# Altium schematic sheet dram.SCHDOC: Gecko3: DDR SDRAM
size A3; Organization: Berne School of Applied Science; Address1: School of Engineering and; Address2: Information Technology; Address3: Quellgasse 21; Address4: CH-2501 Biel; Revision: 0.9; SheetNumber: 6; SheetTotal: 18
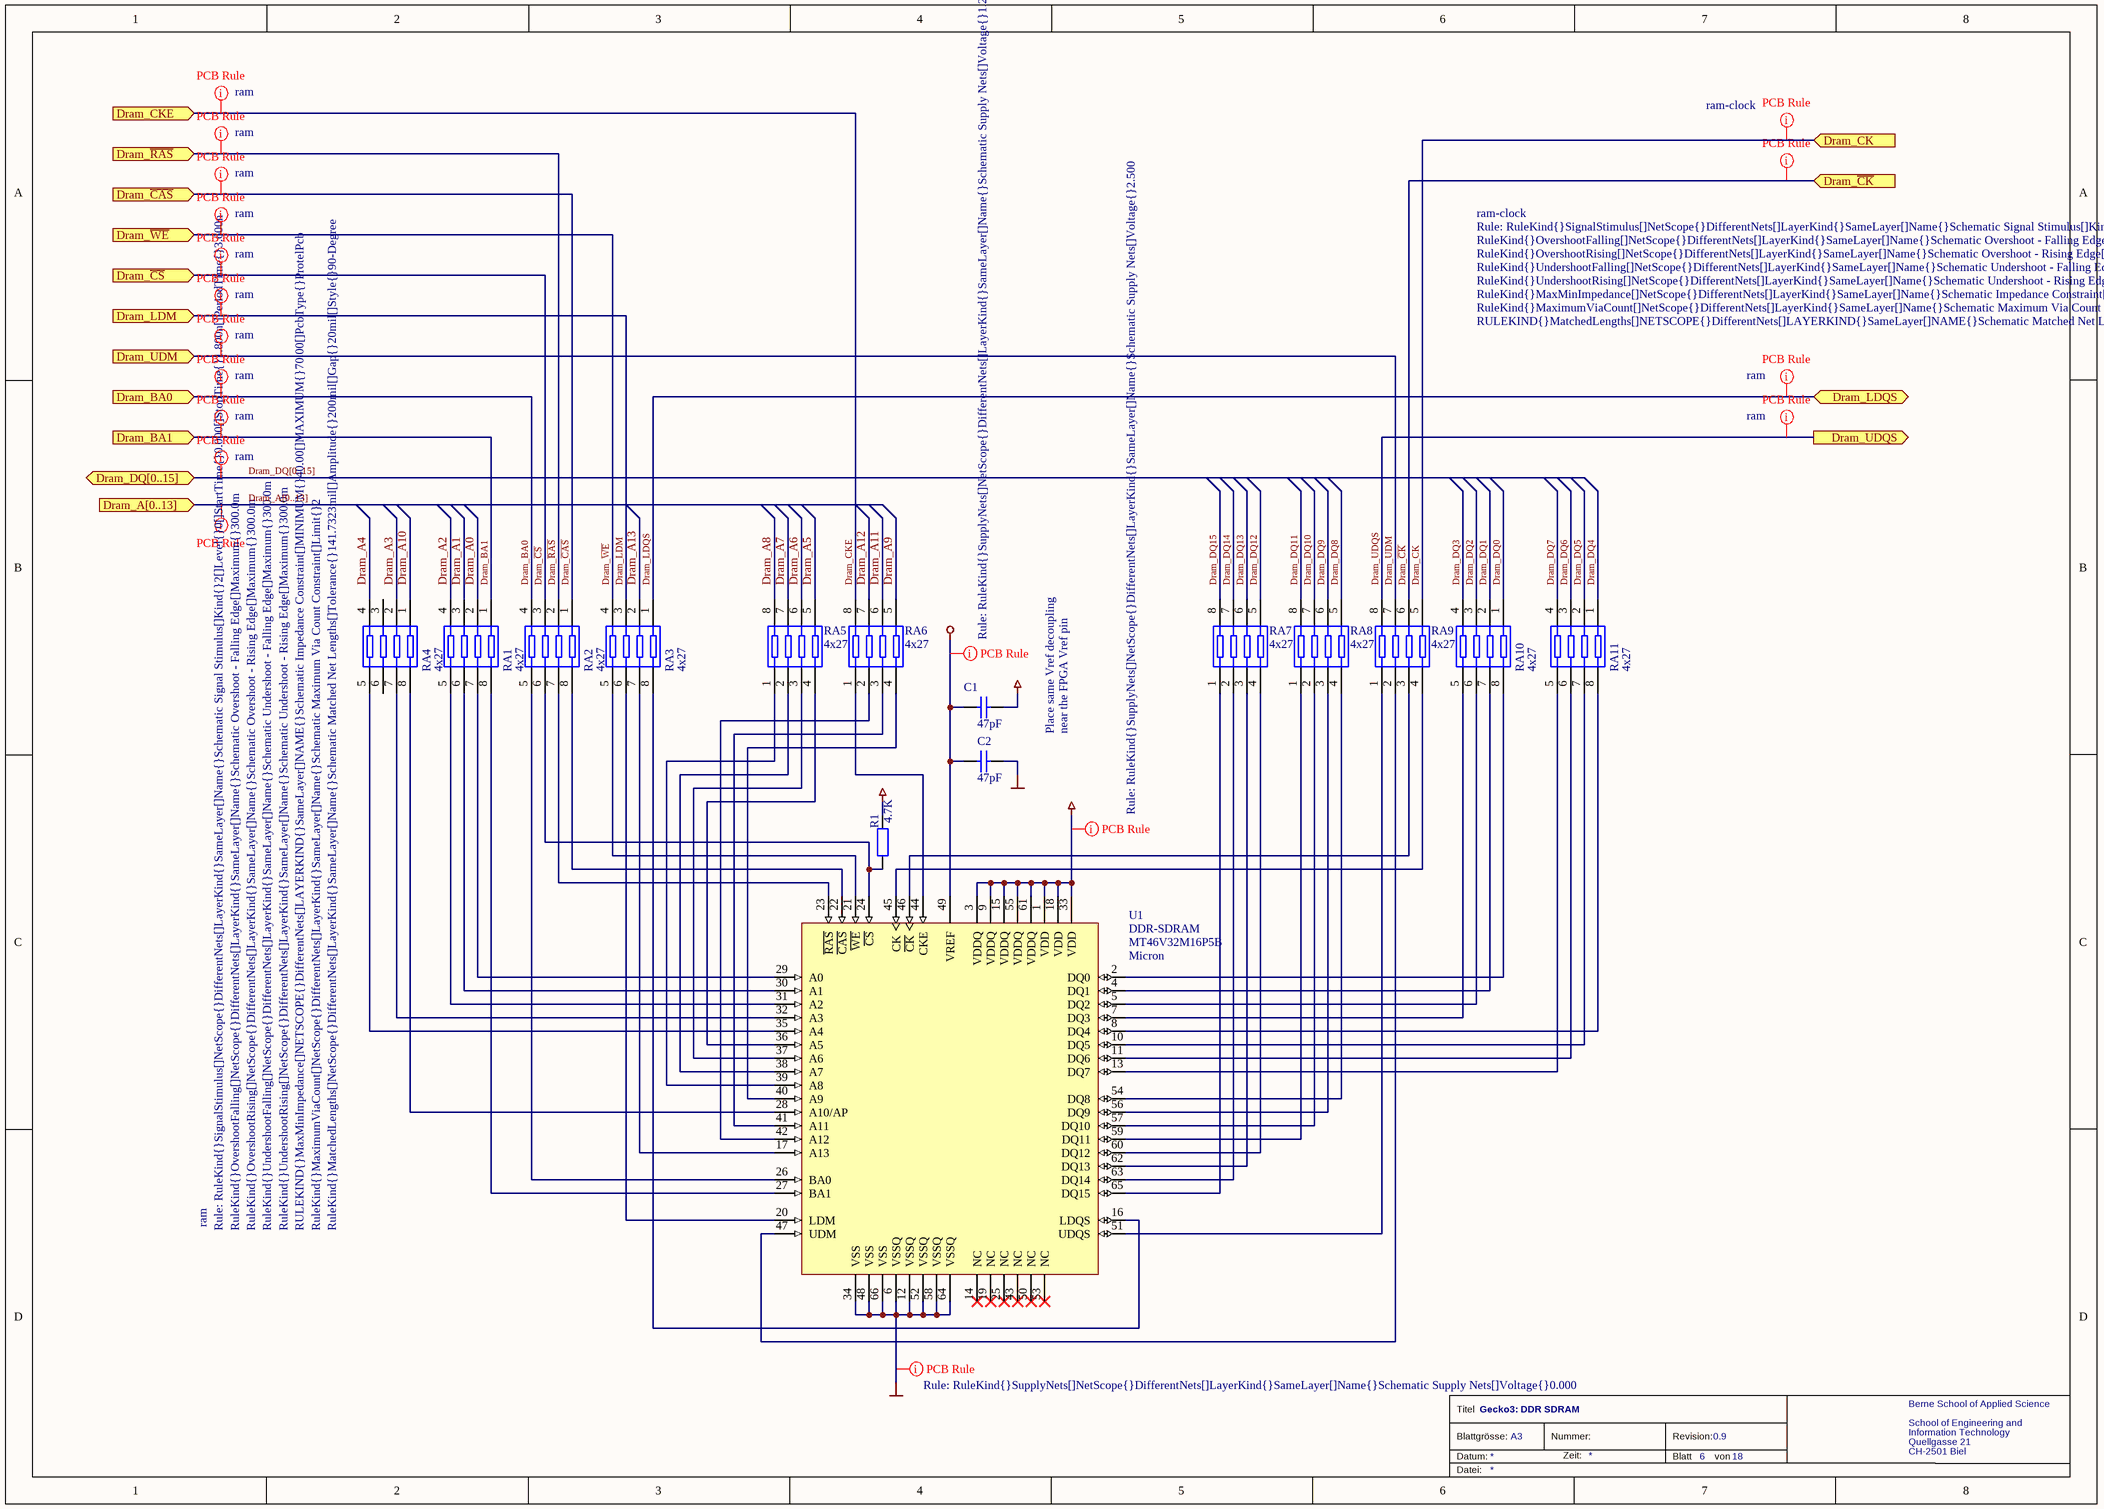
[diagram p0: dram.SCHDOC]

## Parts
C1  value 47pF  [0402]  (hidden comment: Cap)
C2  value 47pF  [0402]  (hidden comment: Cap)
R1  value 4.7K  [0402]  (hidden comment: Res2)
RA1  value 4x27  [1206_ARRAY]
RA2  value 4x27  [1206_ARRAY]
RA3  value 4x27  [1206_ARRAY]
RA4  value 4x27  [1206_ARRAY]
RA5  value 4x27  [1206_ARRAY]
RA6  value 4x27  [1206_ARRAY]
RA7  value 4x27  [1206_ARRAY]
RA8  value 4x27  [1206_ARRAY]
RA9  value 4x27  [1206_ARRAY]
RA10  value 4x27  [1206_ARRAY]
RA11  value 4x27  [1206_ARRAY]
U1  DDR-SDRAM  value MT46V32M16P5B  vendor: Micron  [TSOP66]

## Ports
Dram_A[0..13] (in), Dram_BA0 (in), Dram_BA1 (in), Dram_CK (in), Dram_CKE (in), Dram_DQ[0..15] (bidir), Dram_LDM (in), Dram_LDQS (bidir), Dram_UDM (in), Dram_UDQS (out), Dram_~{CAS} (in), Dram_~{CK} (in), Dram_~{CS} (in), Dram_~{RAS} (in), Dram_~{WE} (in)

## Nets
2.5V: C1.1 R1.2 U1.1(VDD) U1.3(VDDQ) U1.9(VDDQ) U1.15(VDDQ) U1.18(VDD) U1.33(VDD) U1.55(VDDQ) U1.61(VDDQ)
GND: C2.1 U1.6(VSSQ) U1.12(VSSQ) U1.34(VSS) U1.48(VSS) U1.52(VSSQ) U1.58(VSSQ) U1.64(VSSQ) U1.66(VSS)
Vref: C1.2 C2.2 U1.49(VREF)
Dram_A0: RA1.2
Dram_A1: RA1.3
Dram_A2: RA1.4
Dram_A3: RA4.2
Dram_A4: RA4.4
Dram_A5: RA5.5
Dram_A6: RA5.6
Dram_A7: RA5.7
Dram_A8: RA5.8
Dram_A9: RA6.5
Dram_A10: RA4.1
Dram_A11: RA6.6
Dram_A12: RA6.7
Dram_A13: RA3.2
Dram_BA0: RA2.4 ; port Dram_BA0
Dram_BA1: RA1.1 ; port Dram_BA1
Dram_~{CAS}: RA2.1 ; port Dram_~{CAS}
Dram_~{CK}: RA9.6 ; port Dram_~{CK}
Dram_~{CS}: RA2.3 ; port Dram_~{CS}
Dram_CK: RA9.5 ; port Dram_CK
Dram_CKE: RA6.8 ; port Dram_CKE
Dram_DQ0: RA10.1
Dram_DQ1: RA10.2
Dram_DQ2: RA10.3
Dram_DQ3: RA10.4
Dram_DQ4: RA11.1
Dram_DQ5: RA11.2
Dram_DQ6: RA11.3
Dram_DQ7: RA11.4
Dram_DQ8: RA8.5
Dram_DQ9: RA8.6
Dram_DQ10: RA8.7
Dram_DQ11: RA8.8
Dram_DQ12: RA7.5
Dram_DQ13: RA7.6
Dram_DQ14: RA7.7
Dram_DQ15: RA7.8
Dram_LDM: RA3.3 ; port Dram_LDM
Dram_LDQS: RA3.1 ; port Dram_LDQS
Dram_~{RAS}: RA2.2 ; port Dram_~{RAS}
Dram_UDM: RA9.7 ; port Dram_UDM
Dram_UDQS: RA9.8 ; port Dram_UDQS
Dram_~{WE}: RA3.4 ; port Dram_~{WE}
NetR1_1: R1.1 RA2.6 U1.24(~{CS})
NetRA1_5: RA1.5 U1.31(A2)
NetRA1_6: RA1.6 U1.30(A1)
NetRA1_7: RA1.7 U1.29(A0)
NetRA1_8: RA1.8 U1.27(BA1)
NetRA2_5: RA2.5 U1.26(BA0)
NetRA2_7: RA2.7 U1.23(~{RAS})
NetRA2_8: RA2.8 U1.22(~{CAS})
NetRA3_5: RA3.5 U1.21(~{WE})
NetRA3_6: RA3.6 U1.20(LDM)
NetRA3_7: RA3.7 U1.17(A13)
NetRA3_8: RA3.8 U1.16(LDQS)
NetRA4_5: RA4.5 U1.35(A4)
NetRA4_7: RA4.7 U1.32(A3)
NetRA4_8: RA4.8 U1.28(A10/AP)
NetRA5_1: RA5.1 U1.39(A8)
NetRA5_2: RA5.2 U1.38(A7)
NetRA5_3: RA5.3 U1.37(A6)
NetRA5_4: RA5.4 U1.36(A5)
NetRA6_1: RA6.1 U1.44(CKE)
NetRA6_2: RA6.2 U1.42(A12)
NetRA6_3: RA6.3 U1.41(A11)
NetRA6_4: RA6.4 U1.40(A9)
NetRA7_1: RA7.1 U1.65(DQ15)
NetRA7_2: RA7.2 U1.63(DQ14)
NetRA7_3: RA7.3 U1.62(DQ13)
NetRA7_4: RA7.4 U1.60(DQ12)
NetRA8_1: RA8.1 U1.59(DQ11)
NetRA8_2: RA8.2 U1.57(DQ10)
NetRA8_3: RA8.3 U1.56(DQ9)
NetRA8_4: RA8.4 U1.54(DQ8)
NetRA9_1: RA9.1 U1.51(UDQS)
NetRA9_2: RA9.2 U1.47(UDM)
NetRA9_3: RA9.3 U1.46(~{CK})
NetRA9_4: RA9.4 U1.45(CK)
NetRA10_5: RA10.5 U1.7(DQ3)
NetRA10_6: RA10.6 U1.5(DQ2)
NetRA10_7: RA10.7 U1.4(DQ1)
NetRA10_8: RA10.8 U1.2(DQ0)
NetRA11_5: RA11.5 U1.13(DQ7)
NetRA11_6: RA11.6 U1.11(DQ6)
NetRA11_7: RA11.7 U1.10(DQ5)
NetRA11_8: RA11.8 U1.8(DQ4)

Not connected (* = marked no-connect by the designer): RA4 3 6; U1 14(NC)* 19(NC)* 25(NC)* 43(NC)* 50(NC)* 53(NC)*

## Buses and harness runs
bus Dram_A[0..13] = port Dram_A[0..13]
bus Dram_DQ[0..15] = port Dram_DQ[0..15]

## Layout directives
rule Supply Nets [Voltage =  2.500]: 2.5V
rule Supply Nets [Voltage =  1.250]: Vref
rule Supply Nets [Voltage =  0.000]: GND
rule Signal Stimulus [Kind - Periodic Pulse    Level - Low    Start Time =  0.000    Stop Time =  1.800n    Period Time =  3.600n]; rule Overshoot - Falling Edge [Max =  300.0m]; rule Overshoot - Rising Edge [Max =  300.0m]; rule Undershoot - Falling Edge [Max =  300.0m]; rule Undershoot - Rising Edge [Max =  300.0m]; rule Impedance Constraint [Min = 40.00    Max = 70.00    ]; rule Maximum Via Count Constraint [Max Count = 2]; rule Matched Net Lengths [Tolerance = 3.6mm    Style - 90 Degrees    Amplitude = 5.08mm    Gap = 0.508mm    ]; net class ram: (no net found under the mark)
rule Signal Stimulus [Kind - Periodic Pulse    Level - Low    Start Time =  0.000    Stop Time =  1.800n    Period Time =  3.600n]; rule Overshoot - Falling Edge [Max =  300.0m]; rule Overshoot - Rising Edge [Max =  300.0m]; rule Undershoot - Falling Edge [Max =  300.0m]; rule Undershoot - Rising Edge [Max =  300.0m]; rule Impedance Constraint [Min =  40.00    Max =  70.00    ]; rule Maximum Via Count Constraint [Max Count = 2]; rule Matched Net Lengths [Tolerance = 1mm    Style - 90 Degrees    Amplitude = 5.08mm    Gap = 0.508mm    ]; net class ram-clock: Dram_~{CK}
net class ram-clock: Dram_CK
net class ram: (no net found under the mark), Dram_BA0, Dram_BA1, Dram_CKE, Dram_LDM, Dram_LDQS, Dram_UDM, Dram_UDQS, Dram_~{CAS}, Dram_~{CS}, Dram_~{RAS}, Dram_~{WE}

## Notes on the sheet
- Place same Vref decoupling
- near the FPGA Vref pin
- Titel
- Blattgrösse:
- Datum:
- A3
- Nummer:
- Zeit:
- Revision:
- Blatt
- von
- Datei:

## Library data of the parts
C1 C2 = Cap: Capacitor; Manufacturer: Murata; Part Number: GRM1555C1H470JZ01D; Class I: Passive; Currency: CHF; Packaging unit: 10; Prize: 0.07; Published: 8-Jun-2000; Revision: July-2002: Re-released for DXP Platform.; Publisher: Altium Limited; Class II: Capacitor; Distributor: Farnell; Distributor Number: 8819670; RoHS: yes
R1 = Res2: Resistor; Manufacturer: PHYCOMP; Part Number: 232270674702; Class I: Passive; Currency: CHF; Packaging unit: 50; Prize: 0.12; Published: 8-Jun-2000; Revision: July-2002: Re-released for DXP Platform.; Publisher: Altium Limited; Class II: Resistor; Distributor: Farnell; Distributor Number: 9239316; RoHS: yes
RA1-RA11 = R_ARRAY_4_SMD: Manufacturer: PHYCOMP; Part Number: 235003410279; Currency: CHF; Packaging unit: 10; Prize: 0.17; Distributor: Farnell; Distributor Number: 9234969; RoHS: yes
U1 = DDR-SDRAM: general model for ddr sdram's; Currency: CHF; lead time: 12 Weeks; Packaging unit: 108; Prize: 15.87; Distributor: Silica; Distributor Number: MT46V32M16P5B; Manufacturer: Micron; Part Number: MT46V32M16P5B; RoHS: yes